# Altium schematic sheet Power.SchDoc
size 279 x 215 mm; SheetNumber: 2; SheetTotal: 3
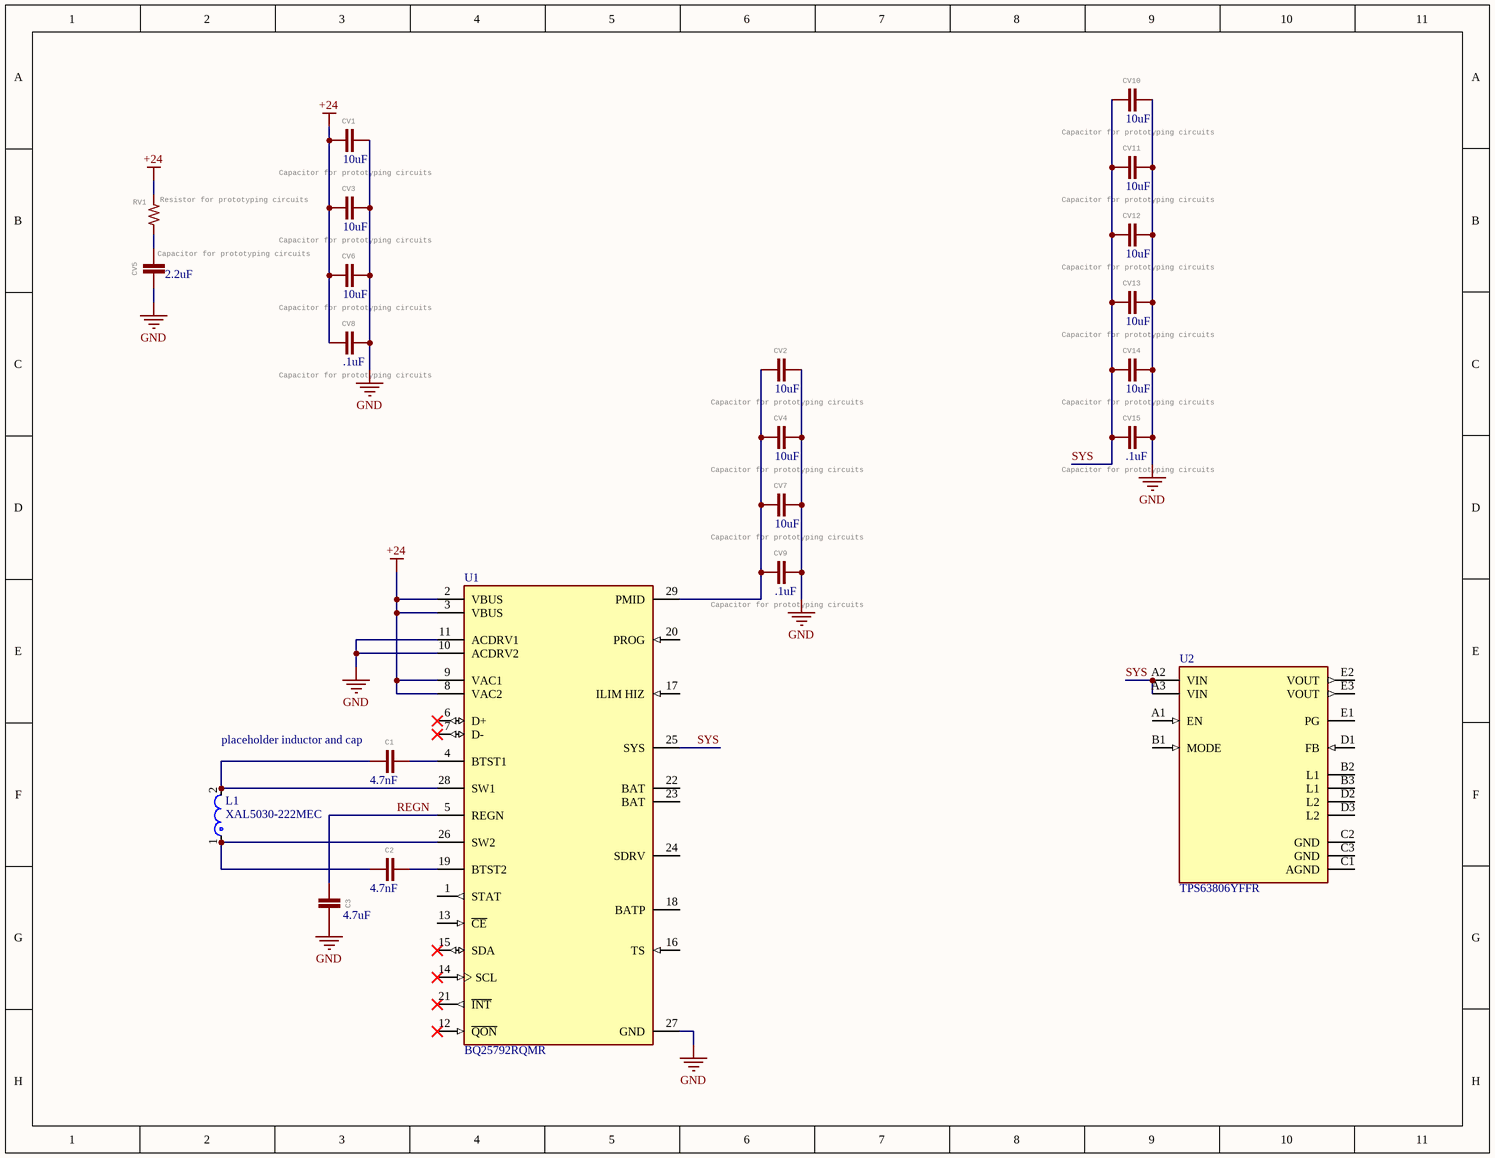
[diagram p0: Power.SchDoc]

## Parts
C1  CAPACITANCE: 4.7nF  [0805-CAP]  (hidden comment: Capacitor, Non-Polarized  VJ...1BC Series Datasheet  Samsung Datasheet  Walsin Datasheet  GRM188R61A226ME15D  GRM188R61E106MA73D  885012006013  2220Y6300105KXTWS2  Yageo Class 2, X5R  TDK C Series  AVX Automotive MLCC   KEMET X7R Series  Kyocera AVX  GRM21BR61H  C1812W104KDRACTU)
C2  CAPACITANCE: 4.7nF  [0805-CAP]  (hidden comment: Capacitor, Non-Polarized  VJ...1BC Series Datasheet  Samsung Datasheet  Walsin Datasheet  GRM188R61A226ME15D  GRM188R61E106MA73D  885012006013  2220Y6300105KXTWS2  Yageo Class 2, X5R  TDK C Series  AVX Automotive MLCC   KEMET X7R Series  Kyocera AVX  GRM21BR61H  C1812W104KDRACTU)
C3  CAPACITANCE: 4.7uF  [0805-CAP]  (hidden comment: Capacitor, Non-Polarized  VJ...1BC Series Datasheet  Samsung Datasheet  Walsin Datasheet  GRM188R61A226ME15D  GRM188R61E106MA73D  885012006013  2220Y6300105KXTWS2  Yageo Class 2, X5R  TDK C Series  AVX Automotive MLCC   KEMET X7R Series  Kyocera AVX  GRM21BR61H  C1812W104KDRACTU)
CV1  Capacitor for prototyping circuits  CAPACITANCE: 10uF  [0603-CAP]
CV2  Capacitor for prototyping circuits  CAPACITANCE: 10uF  [0603-CAP]
CV3  Capacitor for prototyping circuits  CAPACITANCE: 10uF  [0603-CAP]
CV4  Capacitor for prototyping circuits  CAPACITANCE: 10uF  [0603-CAP]
CV5  Capacitor for prototyping circuits  CAPACITANCE: 2.2uF  [0603-CAP]
CV6  Capacitor for prototyping circuits  CAPACITANCE: 10uF  [0603-CAP]
CV7  Capacitor for prototyping circuits  CAPACITANCE: 10uF  [0603-CAP]
CV8  Capacitor for prototyping circuits  CAPACITANCE: .1uF  [0603-CAP]
CV9  Capacitor for prototyping circuits  CAPACITANCE: .1uF  [0603-CAP]
CV10  Capacitor for prototyping circuits  CAPACITANCE: 10uF  [0603-CAP]
CV11  Capacitor for prototyping circuits  CAPACITANCE: 10uF  [0603-CAP]
CV12  Capacitor for prototyping circuits  CAPACITANCE: 10uF  [0603-CAP]
CV13  Capacitor for prototyping circuits  CAPACITANCE: 10uF  [0603-CAP]
CV14  Capacitor for prototyping circuits  CAPACITANCE: 10uF  [0603-CAP]
CV15  Capacitor for prototyping circuits  CAPACITANCE: .1uF  [0603-CAP]
L1  XAL5030-222MEC  [FP-XAL5030-222MEC-MFG]
RV1  Resistor for prototyping circuits  [0603-RES]
U1  BQ25792RQMR  [FP-RQM0029A-MFG]
U2  TPS63806YFFR  [FP-YFF0015-IPC_C]

## Nets
+24: CV1.2 CV3.2 CV6.2 CV8.2 RV1.2 U1.2(VBUS) U1.3(VBUS) U1.8(VAC2) U1.9(VAC1)
GND: C3.1 CV1.1 CV2.1 CV3.1 CV4.1 CV5.2 CV6.1 CV7.1 CV8.1 CV9.1 CV10.1 CV11.1 CV12.1 CV13.1 CV14.1 CV15.1 U1.10(ACDRV2) U1.11(ACDRV1) U1.27(GND)
REGN: C3.2 U1.5(REGN)
SYS: CV10.2 CV11.2 CV12.2 CV13.2 CV14.2 CV15.2 U1.25(SYS) U2.A2(VIN) U2.A3(VIN)
NetC1_1: C1.1 U1.4(BTST1)
NetC1_2: C1.2 L1.2 U1.28(SW1)
NetC2_1: C2.1 U1.19(BTST2)
NetC2_2: C2.2 L1.1 U1.26(SW2)
NetCV2_2: CV2.2 CV4.2 CV7.2 CV9.2 U1.29(PMID)
NetCV5_1: CV5.1 RV1.1

Not connected (* = marked no-connect by the designer): U1 1(STAT) 6(D+)* 7(D-)* 12(~{QON})* 13(~{CE}) 14(SCL)* 15(SDA)* 16(TS) 17(ILIM_HIZ) 18(BATP) 20(PROG) 21(~{INT})* 22(BAT) 23(BAT) 24(SDRV); U2 A1(EN) B1(MODE) B2(L1) B3(L1) C1(AGND) C2(GND) C3(GND) D1(FB) D2(L2) D3(L2) E1(PG) E2(VOUT) E3(VOUT)

## Notes on the sheet
- (near C1) placeholder inductor and cap

## Library data of the parts
C1-C3 = CAPACITOR_?_*0805: MPN: C0805C224K1RACTU; MPN: CC0805MKX5R8BB226; MANUFACTURER: Murata; MPN: GRM21BR61H106KE43L; GateName_1: G$1; DeviceName: 0805; CAPACITANCE: 0.22µF; DKPN: 399-8049-1-ND; MOPN: 80-C0805C224K1R; TOLERANCE: 10%; VOLTAGE: 100V; DKPN: 311-1903-1-ND; MOPN: 603-CC805MKX5R8BB226; TOLERANCE: 20%; VOLTAGE: 25V; CAPACITANCE: 10uF; DKPN: 490-18663-2-ND; MOPN: 81-GRM21BR61H106KE3L; VOLTAGE: 50V; SymbolName_1: CAPACITOR; LibraryName: HyTechDevices; DeviceSetName: CAPACITOR_?_*; Package: 0805-CAP; MANUFACTURER: KEMET; MANUFACTURER: Yageo
CV1-CV15 = CAPACITOR_VALUE: GateName_1: G$1; SymbolName_1: CAPACITOR_VALUE; LibraryName: HyTechDevices; DeviceSetName: CAPACITOR_VALUE; Package: 0603-CAP
L1 = CMP-11268-000158-1: Fixed Inductors 2.2uH Shld 20% 9.2A 14.5mOhms AECQ2 SRF: 38MHz Test Freq: 1MHz; Test Frequency: 100kHz; Core Material: Composite; Shielding: Shielded; DC Resistance (DCR): 14.5mR; RMS Current (Irms): 9.7A; Max Operating Temperature: 125°C; Self Resonant Frequency: 38MHz; Package Quantity: 400; Min Operating Temperature: -40°C; Width: 5.48mm; Series: XAL5030; Inductance: 2.2uH; Length: 5.68mm; RoHS Compliant: Yes; Termination: SMD/SMT; Packaging: Tape and Reel; Max DC Current: 9.2A; Saturation Current: 9.2A; Lead Free: Contains Lead; Mount: Surface Mount; Case/Package: SMD/SMT; Height: 3.1mm; Inductance Tolerance: 20%; Tolerance: 20%
RV1 = RESISTOR_VALUE: GateName_1: G$1; SymbolName_1: RESISTOR_VALUE; LibraryName: HyTechDevices; DeviceSetName: RESISTOR_VALUE; Package: 0603-RES
U1 = BQ25792RQMR: Power Supply Management Circuit, Adjustable, 1 Channel, 3.4, PQCC29; Manufacturer: Texas Instruments; RoHS Compliant: Yes; Supplier: Mouser; Supplier Part Number: 595-BQ25792RQMR; RoHS: Yes; Category: Battery Management; Stock: 1625; Pricing: 1=6.18, 10=5.59, 25=5.33, 50=5.33, 100=4.62, 250=4.42, 500=4.03, 1000=3.51, 3000=3.32, 6000=3.31, 10000=3.32 (USD); Manufacturer Part Number: BQ25792RQMR
U2 = TPS63806YFFR: Switching Regulator, Current-mode, 2.5A, 3100kHz Switching Freq-Max, PBGA15; Manufacturer: Texas Instruments; Supplier: Mouser; Supplier Part Number: 595-TPS63806YFFR; Manufacturer Part Number: TPS63806YFFR; RoHS: Yes; Category: Voltage Regulators - Switching; Stock: 11286; Pricing: 1=2.47, 10=2.22, 25=2.1, 50=2.1, 100=1.8, 250=1.7, 500=1.5, 1000=1.33, 3000=1.25, 6000=1.22, 10000=1.22 (USD); ComponentLink1URL: https://www.ti.com:443/lit/ds/symlink/tps63805.pdf?src-supplier=IHS+Markit; ComponentLink1Description: https://www.ti.com:443/lit/ds/symlink/tps63805.pdf?src-supplier=IHS+Markit